# Altium schematic sheet 470uf.schdoc
size 127 x 99 mm
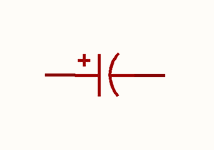
[diagram p0: 470uf.schdoc]

## Parts
C?  470uF  [CAP-TH_BD10.0-P5.00-D0.6-FD-A]  (value not drawn)

## Nets

Not connected (* = marked no-connect by the designer): C? 1 2

## Library data of the parts
C? = SPZ1VM471G13O00RAXXX: Manufacturer: AISHI(艾华集团); Add into BOM: yes; Tolerance: ±20%; Voltage Rating: 35V; Type: Polymer; Lifetime: 2000hrs@105℃; Symbol: SPZ1VM471G13O00RAXXX; Device: SPZ1VM471G13O00RAXXX; LCSC Part Name: 470uF ±20% 35V; Supplier Part: C2691847; Manufacturer Part: SPZ1VM471G13O00RAXXX; Supplier Footprint: 插件,D10xL13mm; JLCPCB Part Class: Extended Part; Datasheet: https://item.szlcsc.com/datasheet/SPZ1VM471G13O00RAXXX/2802119.html; Supplier: LCSC; Convert to PCB: yes; Value: 470uF; Ripple Current: -; Equivalent Series Resistance(ESR): -; Pin Spacing: -; Diameter: 10mm; Height - Seated (Max): 13mm; Operating Temperature: -55℃~+105℃